# EAGLE design BusinessCardPCB (EAGLE 9.2.1)
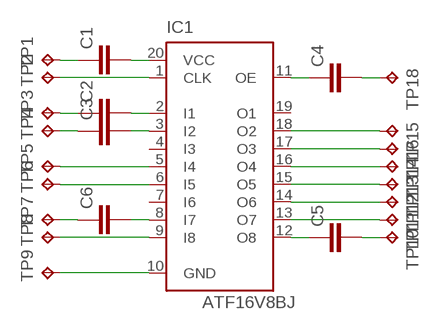
[diagram p0: schematic, sheet 1]

## Parts
C1  C-EUC0603K  [C0603K]
C2  C-EUC0603K  [C0603K]
C3  C-EUC0603K  [C0603K]
C4  C-EUC0603K  [C0603K]
C5  C-EUC0603K  [C0603K]
C6  C-EUC0603K  [C0603K]
IC1  ATF16V8BJ  [PLCC20]
TP1  TPTP10R  [TP10R]
TP2  TPTP10R  [TP10R]
TP3  TPTP10R  [TP10R]
TP4  TPTP10R  [TP10R]
TP5  TPTP10R  [TP10R]
TP6  TPTP10R  [TP10R]
TP7  TPTP10R  [TP10R]
TP8  TPTP10R  [TP10R]
TP9  TPTP10R  [TP10R]
TP10  TPTP10R  [TP10R]
TP11  TPTP10R  [TP10R]
TP12  TPTP10R  [TP10R]
TP13  TPTP10R  [TP10R]
TP14  TPTP10R  [TP10R]
TP15  TPTP10R  [TP10R]
TP16  TPTP10R  [TP10R]
TP18  TPTP10R  [TP10R]

## Nets
N$1: C1.1 TP1.TP
N$2: C1.2 IC1.20(VCC)
N$3: IC1.1(CLK) TP2.TP
N$4: C2.1 TP3.TP
N$5: C2.2 IC1.2(I1)
N$6: C3.2 IC1.3(I2)
N$7: C3.1 TP4.TP
N$8: IC1.5(I4) TP5.TP
N$9: C6.2 IC1.8(I7)
N$10: C6.1 TP7.TP
N$11: IC1.6(I5) TP6.TP
N$12: IC1.9(I8) TP8.TP
N$13: IC1.10(GND) TP9.TP
N$14: C5.1 IC1.12(O8)
N$15: C5.2 TP10.TP
N$16: IC1.13(O7) TP11.TP
N$17: IC1.14(O6) TP12.TP
N$18: IC1.15(O5) TP13.TP
N$19: IC1.16(O4) TP14.TP
N$20: IC1.17(O3) TP16.TP
N$21: IC1.18(O2) TP15.TP
N$22: C4.1 IC1.11(OE)
N$23: C4.2 TP18.TP
Unconnected: IC1.4(I3) IC1.7(I6) IC1.19(O1)

## Library data of the parts
C1-C6 = resistor:C-EU: CAPACITOR, European symbol
IC1 = atmel:ATF16V8B: High perfomance CMOS (electrically erasable) programmable logic device (PLD) ABLE-Atmel-ABEL - P18V8R, P16V8C, P16V8AS, P17V8 COPL Atmel-WinCUPL - G16V8MS, G16V8MA, G16V8AS, G16V8 LOG/IC - GAL16V8_R, GAL16V8_G7, GAL16V8_C), GAL16V8 Tango-PLD - G16V8R, G16V8C, G16V8AS, G16V8 Source: http://www.atmel.com/dyn/resources/prod_documents/DOC0364.PDF; MPN: ATF16V8CZ-15JU; OC_FARNELL: 1551767; OC_NEWARK: 94M6253
TP1-TP16 TP18 = testpad:TP: Test pad

## Board
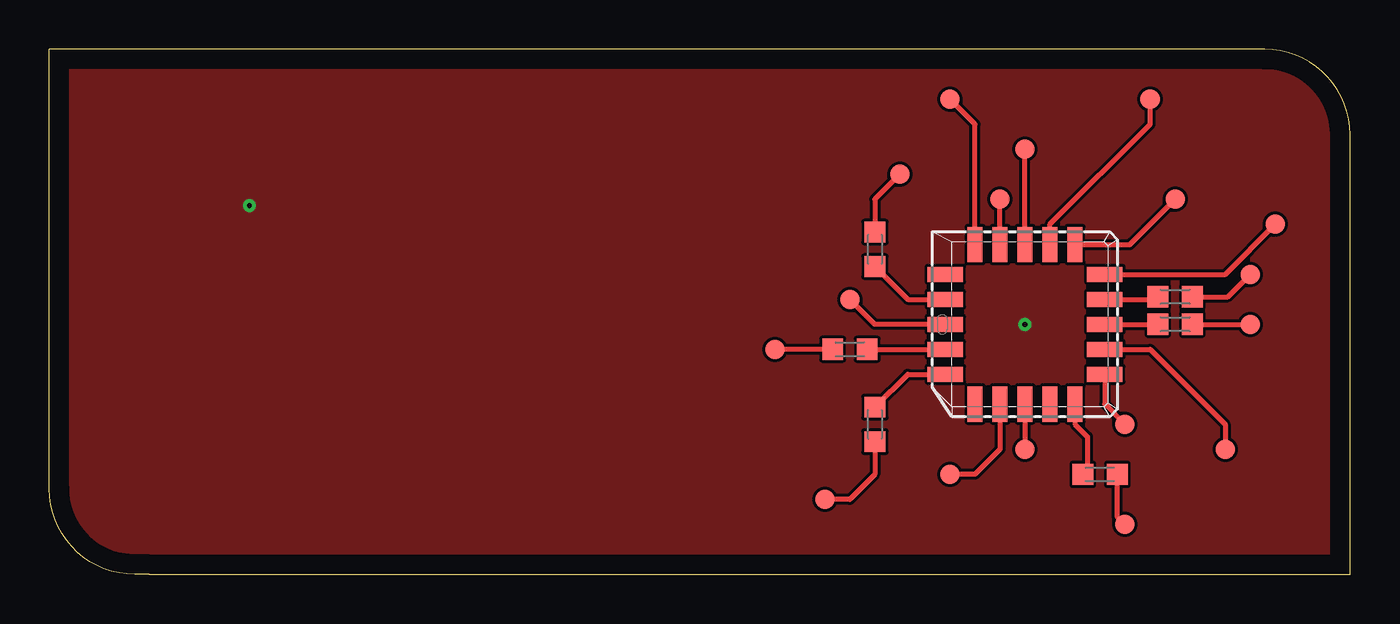
[diagram p1: board, top side]
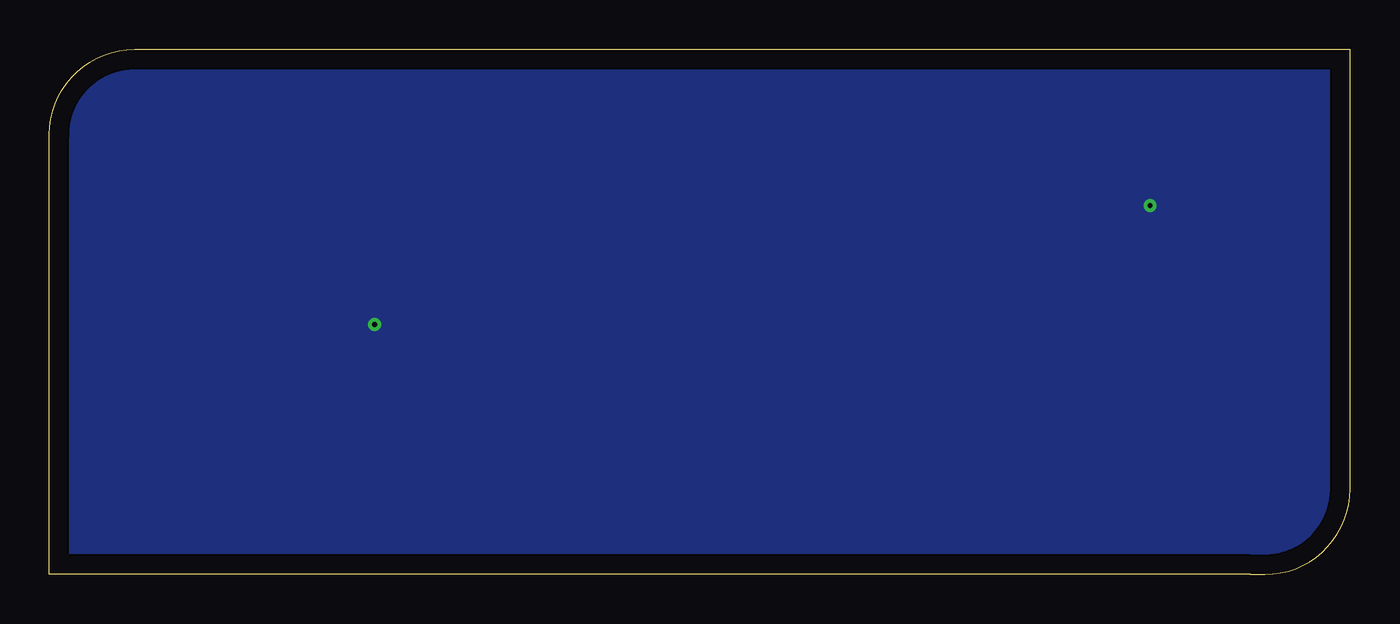
[diagram p2: board, bottom side, seen from below]

Size 66.04 x 26.67 mm. Coordinates in mm from the lower left corner, seen from the top.
Outline: 5.08,0 66.04,0 66.04,22.33 arc90 61.7,26.67 0,26.67 0,4.34 arc90 4.34,0 5.08,0
Copper layers (1*16): Top 0.035mm / dielectric 1.5mm / Bottom 0.035mm
Design rules "default *": minimum track width 6mil, minimum drill 0.35mm, track to track 6mil, track to pad 6mil, pad to pad 6mil, via to via 6mil, smd to smd 6mil, copper to edge 40mil, drill to drill 6mil, minimum pad ring 10mil, minimum via ring 8mil, stop-mask expansion 4mil, vias tented up to drill 100mil, thermal gap 10mil

### Footprints (pad centres in the part's own frame; a part is rotated, then mirrored left to right if it is on the bottom)
C0603K = smd 1.05 x 1.08: 1 -0.875,0; 2 0.875,0
PLCC20 = smd 1.8 x 0.76: 1 -4.05,0; 2 -4.05,-1.27; 3 -4.05,-2.54; 9 4.05,-2.54; 10 4.05,-1.27; 11 4.05,0; 12 4.05,1.27; 13 4.05,2.54; 19 -4.05,2.54; 20 -4.05,1.27 | smd 0.76 x 1.8: 4 -2.54,-4.05; 5 -1.27,-4.05; 6 0,-4.05; 7 1.27,-4.05; 8 2.54,-4.05; 14 2.54,4.05; 15 1.27,4.05; 16 0,4.05; 17 -1.27,4.05; 18 -2.54,4.05
TP10R = smd 1 x 1: TP 0,0

### Placement (x,y rotation side)
C1  41.91,16.51 270 top
C2  40.64,11.43 0 top
C3  41.91,7.62 90 top
C4  57.15,12.7 0 top
C5  57.15,14.1 0 top
C6  53.34,5.08 180 top
IC1  49.53,12.7 0 top
TP1  43.18,20.32 0 top
TP2  40.64,13.97 90 top
TP3  36.83,11.43 90 top
TP4  39.37,3.81 90 top
TP5  45.72,5.08 90 top
TP6  49.53,6.35 90 top
TP7  54.61,2.54 90 top
TP8  54.61,7.62 90 top
TP9  59.69,6.35 90 top
TP10  60.96,15.24 90 top
TP11  62.23,17.78 90 top
TP12  57.15,19.05 90 top
TP13  55.88,24.13 90 top
TP14  49.53,21.59 90 top
TP15  45.72,24.13 90 top
TP16  48.26,19.05 90 top
TP18  60.96,12.7 90 top

### Tracks (layer width: path | path; a pad name or v marks a point on that pad's centre or on a via)
N$1
  Top 0.254: TP1.TP 41.91,19.05 C1.1
N$2
  Top 0.254: C1.2 43.58,13.97 IC1.20
N$3
  Top 0.254: IC1.1 41.91,12.7 TP2.TP
N$4
  Top 0.254: C2.1 TP3.TP
N$5
  Top 0.254: C2.2 IC1.2
N$6
  Top 0.254: C3.2 43.58,10.16 IC1.3
N$7
  Top 0.254: C3.1 41.91,5.08 40.64,3.81 TP4.TP
N$8
  Top 0.254: IC1.5 48.26,6.35 46.99,5.08 TP5.TP
N$9
  Top 0.254: 52.45,5.09 C6.2 52.7,5.32 52.7,6.98 52.07,7.62 IC1.8
N$10
  Top 0.254: TP7.TP 54.22,2.94 C6.1
N$11
  Top 0.254: IC1.6 TP6.TP
N$12
  Top 0.254: IC1.9 53.58,8.65 TP8.TP
N$13
  Top 0.254: IC1.10 55.88,11.43 59.69,7.62 TP9.TP
N$14
  Top 0.254: IC1.12 56.15,13.97 C5.1
N$15
  Top 0.254: C5.2 59.82,14.1 TP10.TP
N$16
  Top 0.254: IC1.13 59.69,15.24 TP11.TP
N$17
  Top 0.254: IC1.14 54.85,16.75 TP12.TP
N$18
  Top 0.254: IC1.15 50.8,17.78 55.88,22.86 TP13.TP
N$19
  Top 0.254: IC1.16 TP14.TP
N$20
  Top 0.254: IC1.17 TP16.TP
N$21
  Top 0.254: IC1.18 46.99,22.86 TP15.TP
N$22
  Top 0.254: IC1.11 C4.1
N$23
  Top 0.254: C4.2 TP18.TP
VCC  (via drill 0.25)
  other vias: 49.53,12.7 10.16,18.73
  pour Top: -1.27,27.94 67.31,27.94 67.31,-1.27 -1.27,-1.27
  pour Bottom: -1.27,27.94 67.31,27.94 67.31,-1.27 -1.27,-1.27

### Text on the board
tStop: Performance Automotive Electronics | engineer x = { / .name = "Stephen Murphy", / .title = "Embedded Software Engineer", / .phone = "(720)-434-0380", / .email = "stephen@murphy.technology", / .web = "www.murphy.technology" / };